# EAGLE design TPA6139A2 (EAGLE 7.2.0)
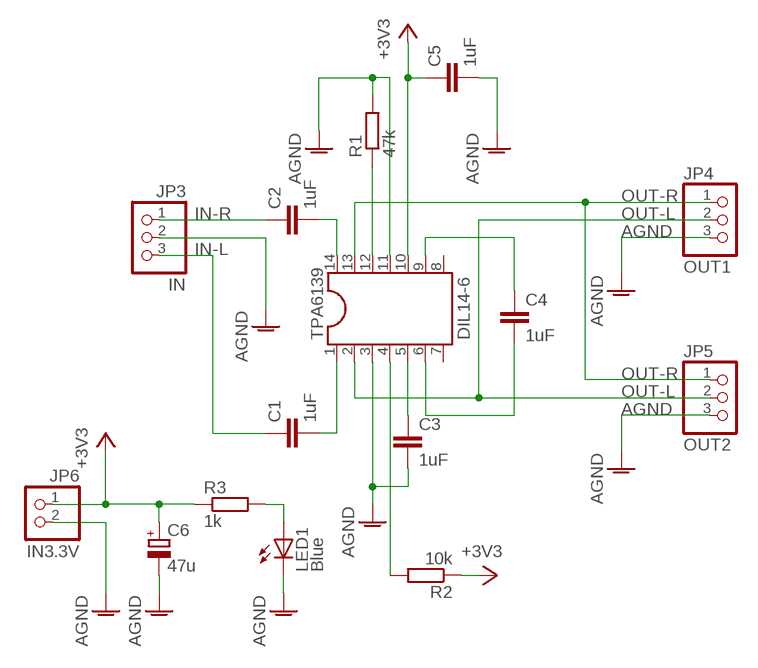
[diagram p0: schematic, sheet 1]

## Parts
C1  1uF  C-EU050-050X075  [C050-050X075]
C2  1uF  C-EU050-050X075  [C050-050X075]
C3  1uF  C-EU050-024X044  [C050-024X044]
C4  1uF  C-EU050-024X044  [C050-024X044]
C5  1uF  C-EU050-024X044  [C050-024X044]
C6  47u  CPOL-EUTT2D5L  [TT2D5L]
JP3  IN  PINHD-1X3  [1X03]
JP4  OUT1  PINHD-1X3  [1X03]
JP5  OUT2  PINHD-1X3  [1X03]
JP6  IN3.3V  PINHD-1X2  [1X02]
LED1  Blue  LED3MM  [LED3MM]
R1  47k  R-EU_0207/7  [0207/7]
R2  10k  R-EU_0207/7  [0207/7]
R3  1k  R-EU_0207/7  [0207/7]
TPA6139  DIL14-6  [DIL14-6]

## Nets
+3V3: C5.1 C6.+ JP6.1 R2.1 R3.1 TPA6139.10
AGND: C3.2 C5.2 C6.- JP3.2 JP4.3 JP5.3 JP6.2 LED1.K(C) R1.2 TPA6139.3 TPA6139.11
IN-L: C1.1 JP3.3
IN-R: C2.1 JP3.1
N$1: C2.2 TPA6139.14
N$2: C1.2 TPA6139.1
N$3: R2.2 TPA6139.4
N$4: C3.1 TPA6139.5
N$5: R1.1 TPA6139.12
N$6: LED1.A R3.2
N$9: C4.2 TPA6139.6
N$10: C4.1 TPA6139.9
OUT-L: JP4.2 JP5.2 TPA6139.2
OUT-R: JP4.1 JP5.1 TPA6139.13
Unconnected: TPA6139.7 TPA6139.8

## Library data of the parts
C1-C5 = rcl:C-EU: CAPACITOR, European symbol
C6 = rcl:CPOL-EU: POLARIZED CAPACITOR, European symbol
JP3-JP5 = pinhead:PINHD-1X3: PIN HEADER
JP6 = pinhead:PINHD-1X2: PIN HEADER
LED1 = led:LED: LED OSRAM: - CHIPLED LG R971, LG N971, LY N971, LG Q971, LY Q971, LO R971, LY R971 LH N974, LH R974 LS Q976, LO Q976, LY Q976 LO Q996 - Hyper CHIPLED LW Q18S LB Q993, LB Q99A, LB R99A - SideLED LS A670, LO A670, LY A670, LG A670, LP A670 LB A673, LV A673, LT A673, LW A673 LH A674 LY A675 LS A676, LA A676, LO A676, LY A676, LW A676 LS A679, LY A679, LG A679 - Hyper Micro SIDELED® LS Y876, LA Y876, LO Y876, LY Y876 LT Y87S - SmartLED LW L88C, LW L88S LB L89C, LB L89S, LG L890 LS L89K, LO L89K, LY L89K LS L896, LA L896, LO L896, LY L896 - TOPLED LS T670, LO T670, LY T670, LG T670, LP T670 LSG T670, LSP T670, LSY T670, LOP T670, LYG T670 LG T671, LOG T671, LSG T671 LB T673, LV T673, LT T673, LW T673 LH T674 LS T676, LA T676, LO T676, LY T676, LB T676, LH T676, LSB T676, LW T676 LB T67C, LV T67C, LT T67C, LS T67K, LO T67K, LY T67K, LW E67C LS E67B, LA E67B, LO E67B, LY E67B, LB E67C, LV E67C, LT E67C LW T67C LS T679, LY T679, LG T679 LS T770, LO T770, LY T770, LG T770, LP T770 LB T773, LV T773, LT T773, LW T773 LH T774 LS E675, LA E675, LY E675, LS T675 LS T776, LA T776, LO T776, LY T776, LB T776 LHGB T686 LT T68C, LB T68C - Hyper Mini TOPLED® LB M676 - Mini TOPLED Santana® LG M470 LS M47K, LO M47K, LY M47K Source: http://www.osram.convergy.de LUXEON: - LUMILED® LXK2-PW12-R00, LXK2-PW12-S00, LXK2-PW14-U00, LXK2-PW14-V00 LXK2-PM12-R00, LXK2-PM12-S00, LXK2-PM14-U00 LXK2-PE12-Q00, LXK2-PE12-R00, LXK2-PE12-S00, LXK2-PE14-T00, LXK2-PE14-U00 LXK2-PB12-K00, LXK2-PB12-L00, LXK2-PB12-M00, LXK2-PB14-N00, LXK2-PB14-P00, LXK2-PB14-Q00 LXK2-PR12-L00, LXK2-PR12-M00, LXK2-PR14-Q00, LXK2-PR14-R00 LXK2-PD12-Q00, LXK2-PD12-R00, LXK2-PD12-S00 LXK2-PH12-R00, LXK2-PH12-S00 LXK2-PL12-P00, LXK2-PL12-Q00, LXK2-PL12-R00 Source: www.luxeon.com KINGBRIGHT: KA-3528ASYC Source: www.kingbright.com
R1-R3 = rcl:R-EU_: RESISTOR, European symbol
TPA6139 = mylib:DIL14-6: DIL15-6 DIL 14PIN 600mil

## Board
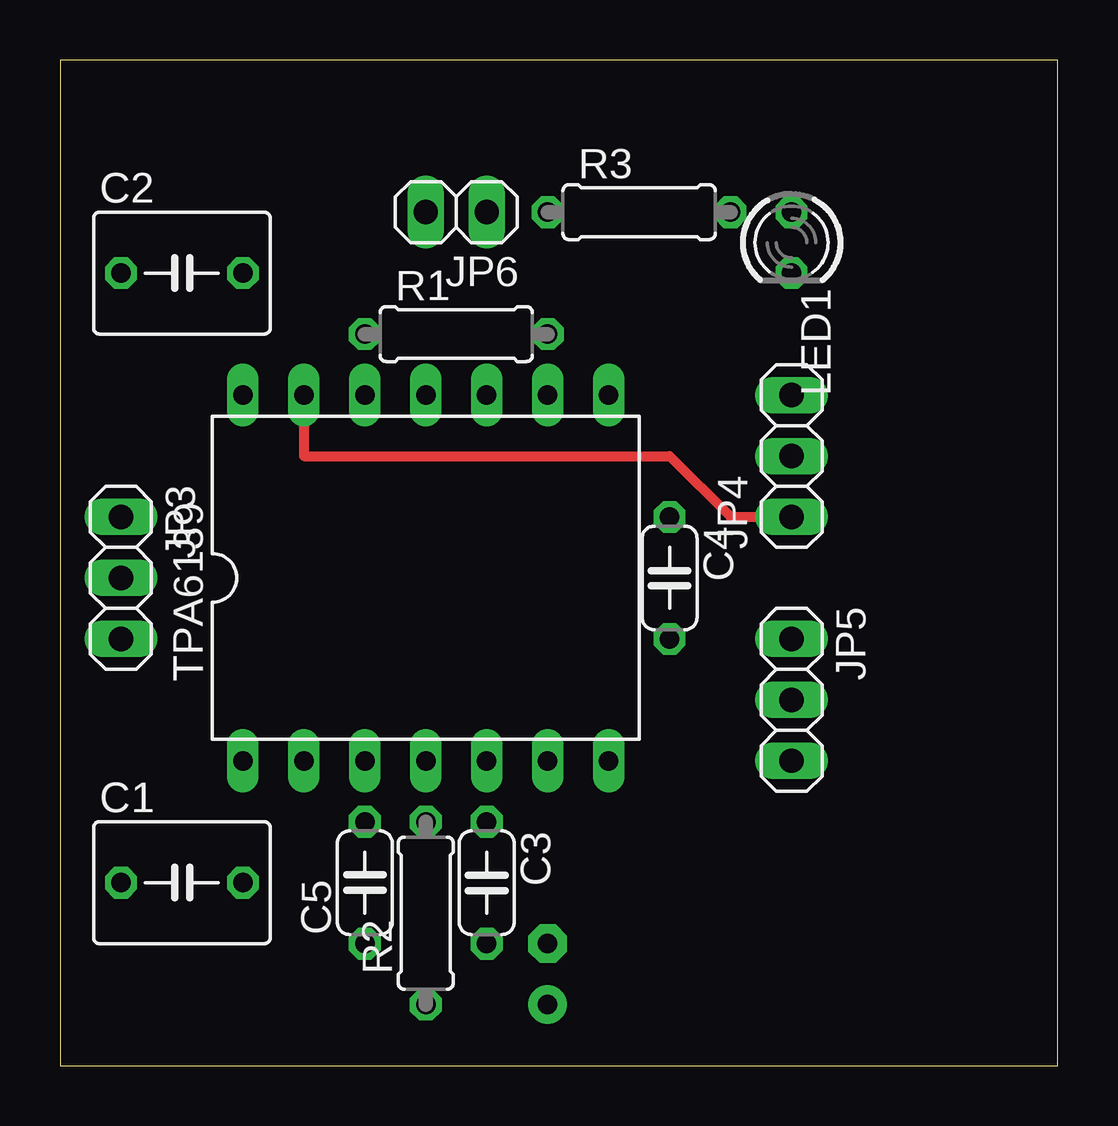
[diagram p1: board, top side]
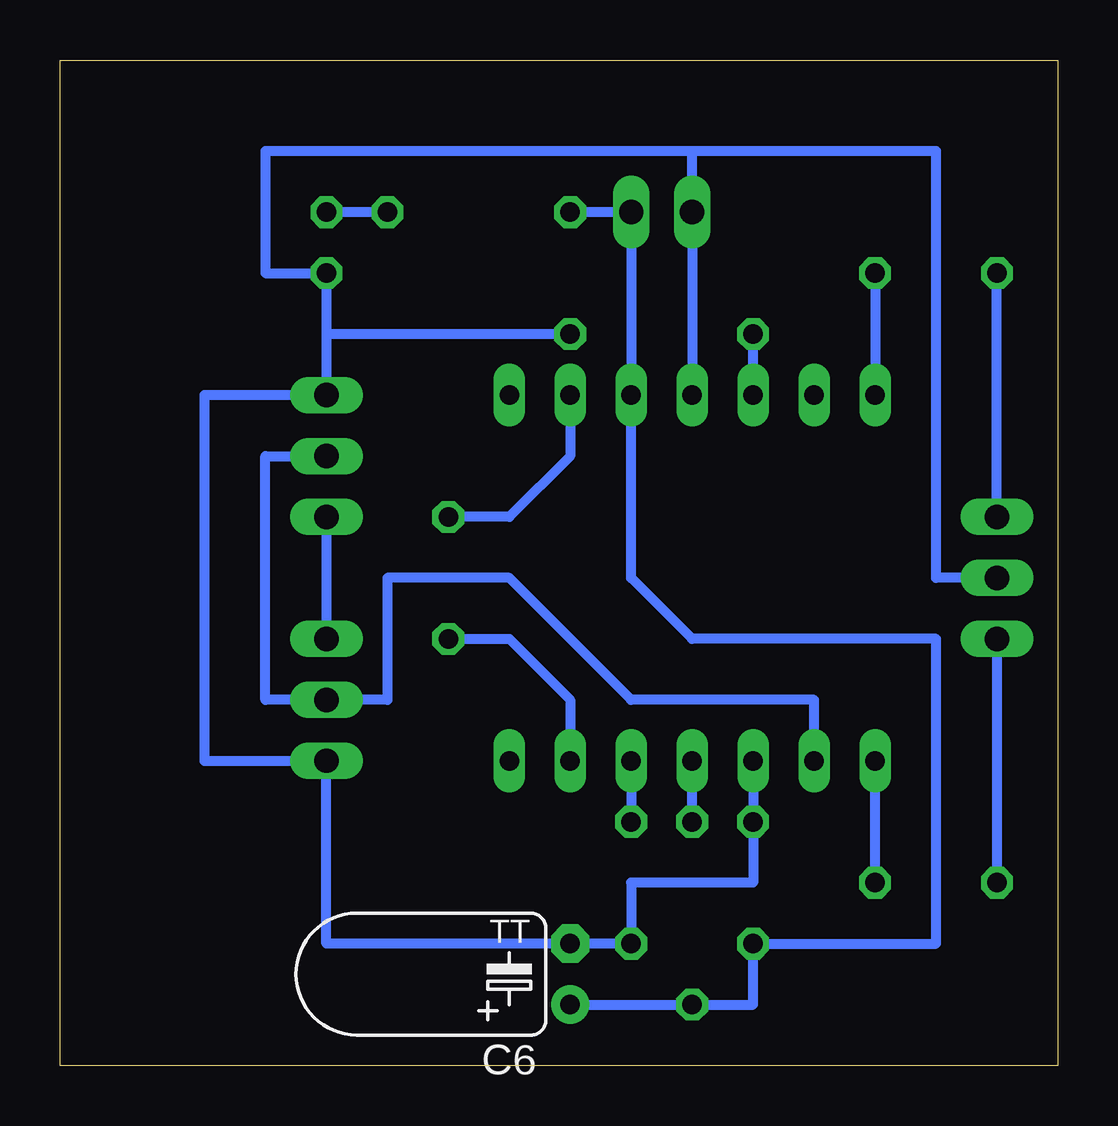
[diagram p2: board, bottom side, seen from below]

Size 41.58 x 41.9 mm. Coordinates in mm from the lower left corner, seen from the top.
Outline: 0,0 41.58,0 41.58,41.9 0,41.9 0,0
Copper layers (1*16): Top 0.035mm / dielectric 1.5mm / Bottom 0.035mm
Design rules "default": minimum track width 10mil, minimum drill 24mil, track to track 8mil, track to pad 8mil, pad to pad 8mil, via to via 8mil, smd to smd 8mil, copper to edge 40mil, drill to drill 8mil, minimum pad ring 10mil, minimum via ring 8mil, stop-mask expansion 4mil, vias tented up to drill 0mil, thermal gap 10mil

### Footprints (pad centres in the part's own frame; a part is rotated, then mirrored left to right if it is on the bottom)
C050-050X075 = drill 0.813 octagon: 1 -2.54,0; 2 2.54,0
C050-024X044 = drill 0.813 octagon: 1 -2.54,0; 2 2.54,0
TT2D5L = drill 0.813 pad 1.6: + -1.27,0 | drill 0.813 pad 1.6 octagon: - 1.27,0
1X03 = drill 1.016 long: 1 -2.54,0; 2 0,0; 3 2.54,0
1X02 = drill 1.016 long: 1 -1.27,0; 2 1.27,0
LED3MM = drill 0.813 octagon: A -1.27,0; K 1.27,0
0207/7 = drill 0.813 octagon: 1 -3.81,0; 2 3.81,0
DIL14-6 = drill 0.813 long: 1 -7.62,-5.08; 2 -5.08,-5.08; 3 -2.54,-5.08; 4 0,-5.08; 5 2.54,-5.08; 6 5.08,-5.08; 7 7.62,-5.08; 8 7.62,10.16; 9 5.08,10.16; 10 2.54,10.16; 11 0,10.16; 12 -2.54,10.16; 13 -5.08,10.16; 14 -7.62,10.16

### Placement (x,y rotation side)
C1  5.08,7.62 0 top
C2  5.08,33.02 0 top
C3  17.78,7.62 270 top
C4  25.4,20.32 270 top
C5  12.7,7.62 90 top
C6  20.32,3.81 90 bottom
JP3  2.54,20.32 270 top
JP4  30.48,25.4 90 top
JP5  30.48,15.24 270 top
JP6  16.51,35.56 180 top
LED1  30.48,34.29 270 top
R1  16.51,30.48 0 top
R2  15.24,6.35 90 top
R3  24.13,35.56 0 top
TPA6139  15.24,17.78 0 top

### Tracks (layer width: path | path; a pad name or v marks a point on that pad's centre or on a via)
+3V3
  Bottom 0.406: R3.1 JP6.1 TPA6139.10 17.78,20.32 15.24,17.78 5.08,17.78 5.08,5.08 C5.1 12.7,2.54 R2.1 C6.+
AGND
  Bottom 0.406: TPA6139.11 JP6.2 15.24,38.1 | TPA6139.3 C5.2 12.7,7.62 17.78,7.62 C3.2 | JP3.2 5.08,20.32 5.08,38.1 15.24,38.1 | 15.24,38.1 33.02,38.1 33.02,33.02 LED1.K 30.48,30.48 | 30.48,30.48 JP4.3 35.56,27.94 35.56,12.7 JP5.3 30.48,5.08 C3.2 | R1.2 30.48,30.48 | C3.2 C6.-
IN-L
  Bottom 0.406: JP3.3 C1.1
IN-R
  Bottom 0.406: JP3.1 C2.1
N$1
  Bottom 0.406: C2.2 TPA6139.14
N$2
  Bottom 0.406: C1.2 TPA6139.1
N$3
  Bottom 0.406: R2.2 TPA6139.4
N$4
  Bottom 0.406: TPA6139.5 C3.1
N$5
  Bottom 0.406: TPA6139.12 R1.1
N$6
  Bottom 0.406: R3.2 LED1.A
N$9
  Bottom 0.406: C4.2 22.86,17.78 20.32,15.24 TPA6139.6
N$10
  Bottom 0.406: TPA6139.9 20.32,25.4 22.86,22.86 C4.1
OUT-L
  Bottom 0.406: JP4.2 33.02,25.4 33.02,15.24 JP5.2 27.94,15.24 27.94,20.32 22.86,20.32 17.78,15.24 10.16,15.24 TPA6139.2
OUT-R
  Top 0.406: TPA6139.13 10.16,25.4 25.4,25.4 27.94,22.86 JP4.1
  Bottom 0.406: JP4.1 JP5.1